# EAGLE schematic ELWireProximityController (EAGLE 7.7.0)
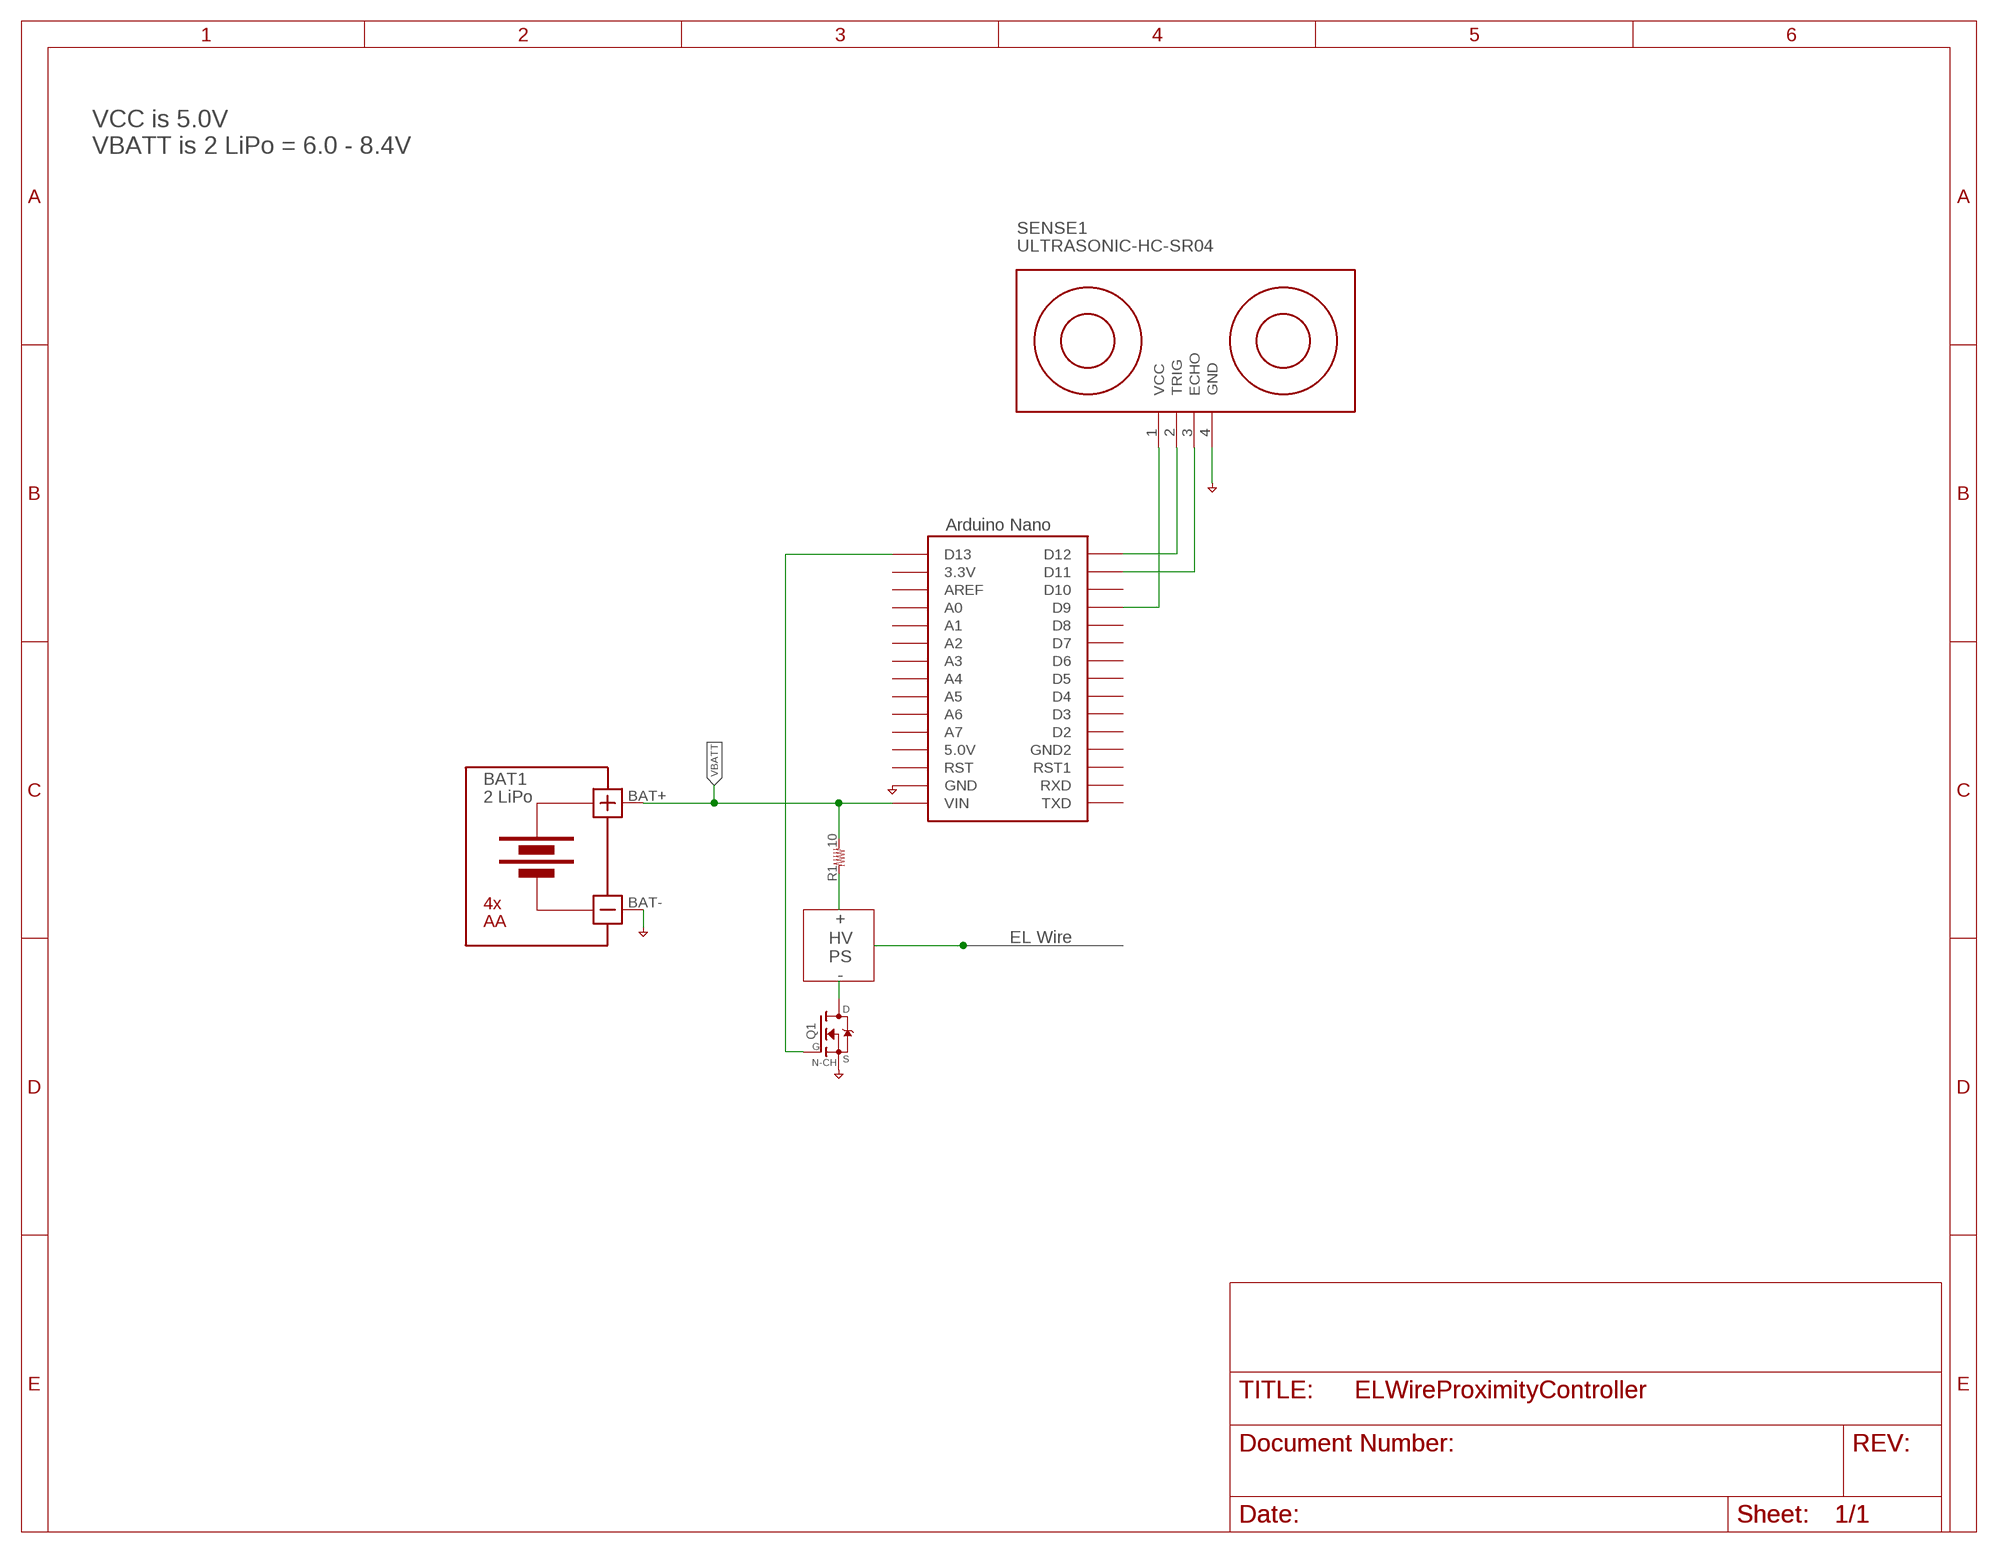
[diagram p0: schematic, sheet 1]

## Parts
BAT1  2 LiPo  BATTERY-HOLDER-2AA  [BATTERY-HOLDER-2AA]
Q1  FET-NCH-SOT23  [SOT23-3]
R1  10  R-THRU-H-0.4  [R-THRU-H-0.4]
SENSE1  ULTRASONIC-HC-SR04  [ULTRASONIC-HC-SR04]
U$1  NANO  [NANO]

## Nets
GND: BAT1.BAT- Q1.2(S) SENSE1.4(GND) U$1.GND
N$1: Q1.3(D)
N$2: SENSE1.2(TRIG) U$1.D12
N$3: SENSE1.3(ECHO) U$1.D11
N$4: Q1.1(G) U$1.D13
N$6: SENSE1.1(VCC) U$1.D9
N$7: R1.1
VBATT: BAT1.BAT+ R1.2 U$1.RAW(VIN)
Unconnected: U$1.3.3V U$1.5V(5.0V) U$1.A0 U$1.A1 U$1.A2 U$1.A3 U$1.A4 U$1.A5 U$1.A6 U$1.A7 U$1.AREF U$1.D2 U$1.D3 U$1.D4 U$1.D5 U$1.D6 U$1.D7 U$1.D8 U$1.D10 U$1.GND1(GND2) U$1.ICSP1 U$1.ICSP2 U$1.ICSP3 U$1.ICSP4 U$1.ICSP5 U$1.ICSP6 U$1.RST U$1.RST1 U$1.RX1(RXD) U$1.TX0(TXD)

## Notes on the sheet
- VCC is 5.0V
  VBATT is 2 LiPo = 6.0 - 8.4V
- EL Wire
- +
  HV
  PS
  -

## Library data of the parts
BAT1 = diy-modules:BATTERY-HOLDER-2AA: Battery Holder 2 x AA Click here to find device on ebay.com <http://www.ebay.com/sch/battery+plastic+holder+aa+2x1.5v>
Q1 = holla:FET-NCH
R1 = holla:R
SENSE1 = diy-modules:ULTRASONIC-HC-SR04: Ultrasonic Ranging Module HC-SR04 More details available here: http://randomnerdtutorials.com/complete-guide-for-ultrasonic-sensor-hc-sr04/ Click here to find device on ebay.com <http://www.ebay.com/sch/hc+sr04+ultrasonic>
U$1 = Arduino-clone:NANO: Arduino Nano